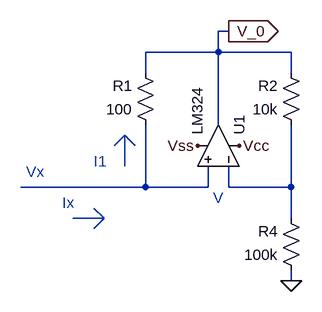
[diagram p0: schematic Lab_1_Circ_2_FuenteHowland.asc]
Lab_1_Circ_2_FuenteHowland.asc, the LTspice schematic file:
Version 4
SHEET 1 1560 868
WIRE 384 -256 368 -256
WIRE 368 -224 368 -256
WIRE 368 -224 256 -224
WIRE 480 -224 368 -224
WIRE 256 -192 256 -224
WIRE 480 -192 480 -224
WIRE 368 -112 368 -224
WIRE 256 -16 256 -112
WIRE 256 -16 64 -16
WIRE 352 -16 352 -48
WIRE 352 -16 256 -16
WIRE 384 -16 384 -48
WIRE 480 -16 480 -112
WIRE 480 -16 384 -16
WIRE 480 32 480 -16
WIRE 480 128 480 112
FLAG 400 -80 Vcc
FLAG 336 -80 Vss
FLAG 384 -256 V_0
IOPIN 384 -256 Out
FLAG 480 128 0
SYMBOL OpAmps\\opamp2 432 -80 M270
SYMATTR InstName U1
SYMATTR Value LM324
SYMBOL res 272 -96 R180
WINDOW 0 36 76 Left 2
WINDOW 3 36 40 Left 2
SYMATTR InstName R1
SYMATTR Value 100
SYMBOL res 496 -96 R180
WINDOW 0 36 76 Left 2
WINDOW 3 36 40 Left 2
SYMATTR InstName R2
SYMATTR Value 10k
SYMBOL res 496 128 R180
WINDOW 0 36 76 Left 2
WINDOW 3 36 40 Left 2
SYMATTR InstName R4
SYMATTR Value 100k
TEXT 360 0 Left 2 ;V
TEXT 72 -40 Left 2 ;Vx
TEXT 128 8 Left 2 ;Ix
TEXT 176 -56 Left 2 ;I1
LINE Normal 192 32 144 32
LINE Normal 192 32 176 16
LINE Normal 176 48 192 32
LINE Normal 224 -96 224 -48
LINE Normal 224 -96 208 -80
LINE Normal 240 -80 224 -96

The netlist it stands for:
* Lab_1_Circ_2_FuenteHowland.asc
XU1 N001 N002 Vcc Vss V_0 LM324  ; pins In+ In- V+ V- OUT
R1 N001 V_0 100
R2 N002 V_0 10k
R4 0 N002 100k
* V
* Vx
* Ix
* I1
.backanno
.end